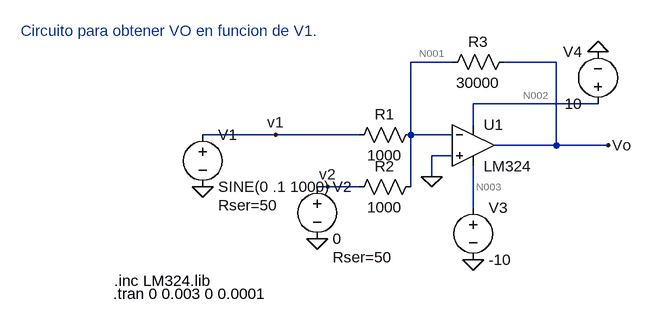
[diagram p0: schematic circuito1.1.asc]
circuito1.1.asc, the LTspice schematic file:
Version 4
SHEET 1 880 680
WIRE 160 16 96 16
WIRE 320 16 240 16
WIRE 384 80 192 80
WIRE 192 112 192 80
WIRE -112 128 -224 128
WIRE 16 128 -112 128
WIRE 96 128 96 16
WIRE 160 128 96 128
WIRE 320 144 320 16
WIRE 320 144 224 144
WIRE 400 144 320 144
WIRE 160 160 128 160
WIRE 128 192 128 160
WIRE -32 208 -48 208
WIRE 16 208 -32 208
WIRE 96 208 96 128
WIRE 192 240 192 176
FLAG -224 208 0
FLAG -48 288 0
FLAG 192 320 0
FLAG 384 0 0
FLAG 400 144 Vo
FLAG -112 128 v1
FLAG -32 208 v2
FLAG 128 192 0
SYMBOL OpAmps\\opamp2 192 80 R0
SYMATTR InstName U1
SYMATTR Value LM324
SYMBOL res 112 112 R90
WINDOW 0 0 56 VBottom 2
WINDOW 3 32 56 VTop 2
SYMATTR InstName R1
SYMATTR Value 1000
SYMBOL res 112 192 R90
WINDOW 0 0 56 VBottom 2
WINDOW 3 32 56 VTop 2
SYMATTR InstName R2
SYMATTR Value 1000
SYMBOL res 256 0 R90
WINDOW 0 0 56 VBottom 2
WINDOW 3 32 56 VTop 2
SYMATTR InstName R3
SYMATTR Value 30000
SYMBOL voltage -224 112 R0
WINDOW 123 0 0 Left 0
WINDOW 39 24 124 Left 2
SYMATTR InstName V1
SYMATTR Value SINE(0 .1 1000)
SYMATTR SpiceLine Rser=50
SYMBOL voltage -48 192 R0
WINDOW 123 0 0 Left 0
WINDOW 39 24 124 Left 2
SYMATTR InstName V2
SYMATTR Value 0
SYMATTR SpiceLine Rser=50
SYMBOL voltage 192 224 R0
WINDOW 123 0 0 Left 0
WINDOW 39 0 0 Left 0
SYMATTR InstName V3
SYMATTR Value -10
SYMBOL voltage 384 96 R180
WINDOW 0 24 96 Left 2
WINDOW 3 24 16 Left 2
WINDOW 123 0 0 Left 0
WINDOW 39 0 0 Left 0
SYMATTR InstName V4
SYMATTR Value 10
TEXT -360 352 Left 2 !.inc LM324.lib
TEXT -362 372 Left 2 !.tran 0 0.003 0 0.0001
TEXT -504 -32 Left 2 ;Circuito para obtener VO en funcion de V1.

The netlist it stands for:
* circuito1.1.asc
XU1 0 N001 N002 N003 Vo LM324  ; pins In+ In- V+ V- OUT
R1 N001 v1 1000
R2 N001 v2 1000
R3 Vo N001 30000
V1 v1 0 SINE(0 .1 1000) Rser=50
V2 v2 0 0 Rser=50
V3 N003 0 -10
V4 N002 0 10
.inc LM324.lib
.tran 0 0.003 0 0.0001
* Circuito para obtener VO en funcion de V1.
.backanno
.end

* Results of the author's LTspice run, read from the files saved beside the schematic
* Operating Point, zero values left out:
*   V(vo) = -2.554 mV
*   V(n003) = -10 V
*   V(n002) = 10 V
*   V(n001) = -33.63 µV
*   V(v1) = -1.601 µV
*   V(v2) = -1.601 µV
*   I(R3) = -84 nA
*   I(R2) = -32.03 nA
*   I(R1) = -32.03 nA
*   I(V4) = -669.9 µA
*   I(V3) = 669.8 µA
*   I(V2) = -32.03 nA
*   I(V1) = -32.03 nA
*   Ix(u1:1) = -19.92 nA
*   Ix(u1:2) = -19.94 nA
*   Ix(u1:3) = 669.9 µA
*   Ix(u1:4) = -669.8 µA
*   Ix(u1:5) = 84 nA
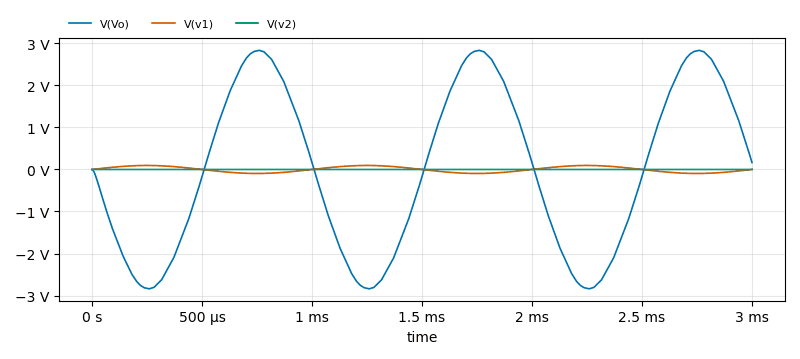
[diagram p1: Transient Analysis of circuito1.1.asc, plotted from the saved traces]
* Transient Analysis, 1 run:
*   V(Vo): min -2.839 V, max 2.834 V, average -4.158 mV, rms 1.988 V, last 163.8 mV
*   V(v1): min -95.05 mV, max 95.05 mV, average 9.094 µV, rms 67.52 mV, last 134.6 µV
*   V(v2): min -137.7 µV, max 134.6 µV, average -2.019 µV, rms 96.54 µV, last 134.6 µV